# EAGLE schematic LowLevelv3 (EAGLE 9.3.1)

## Sheet 1 of 3
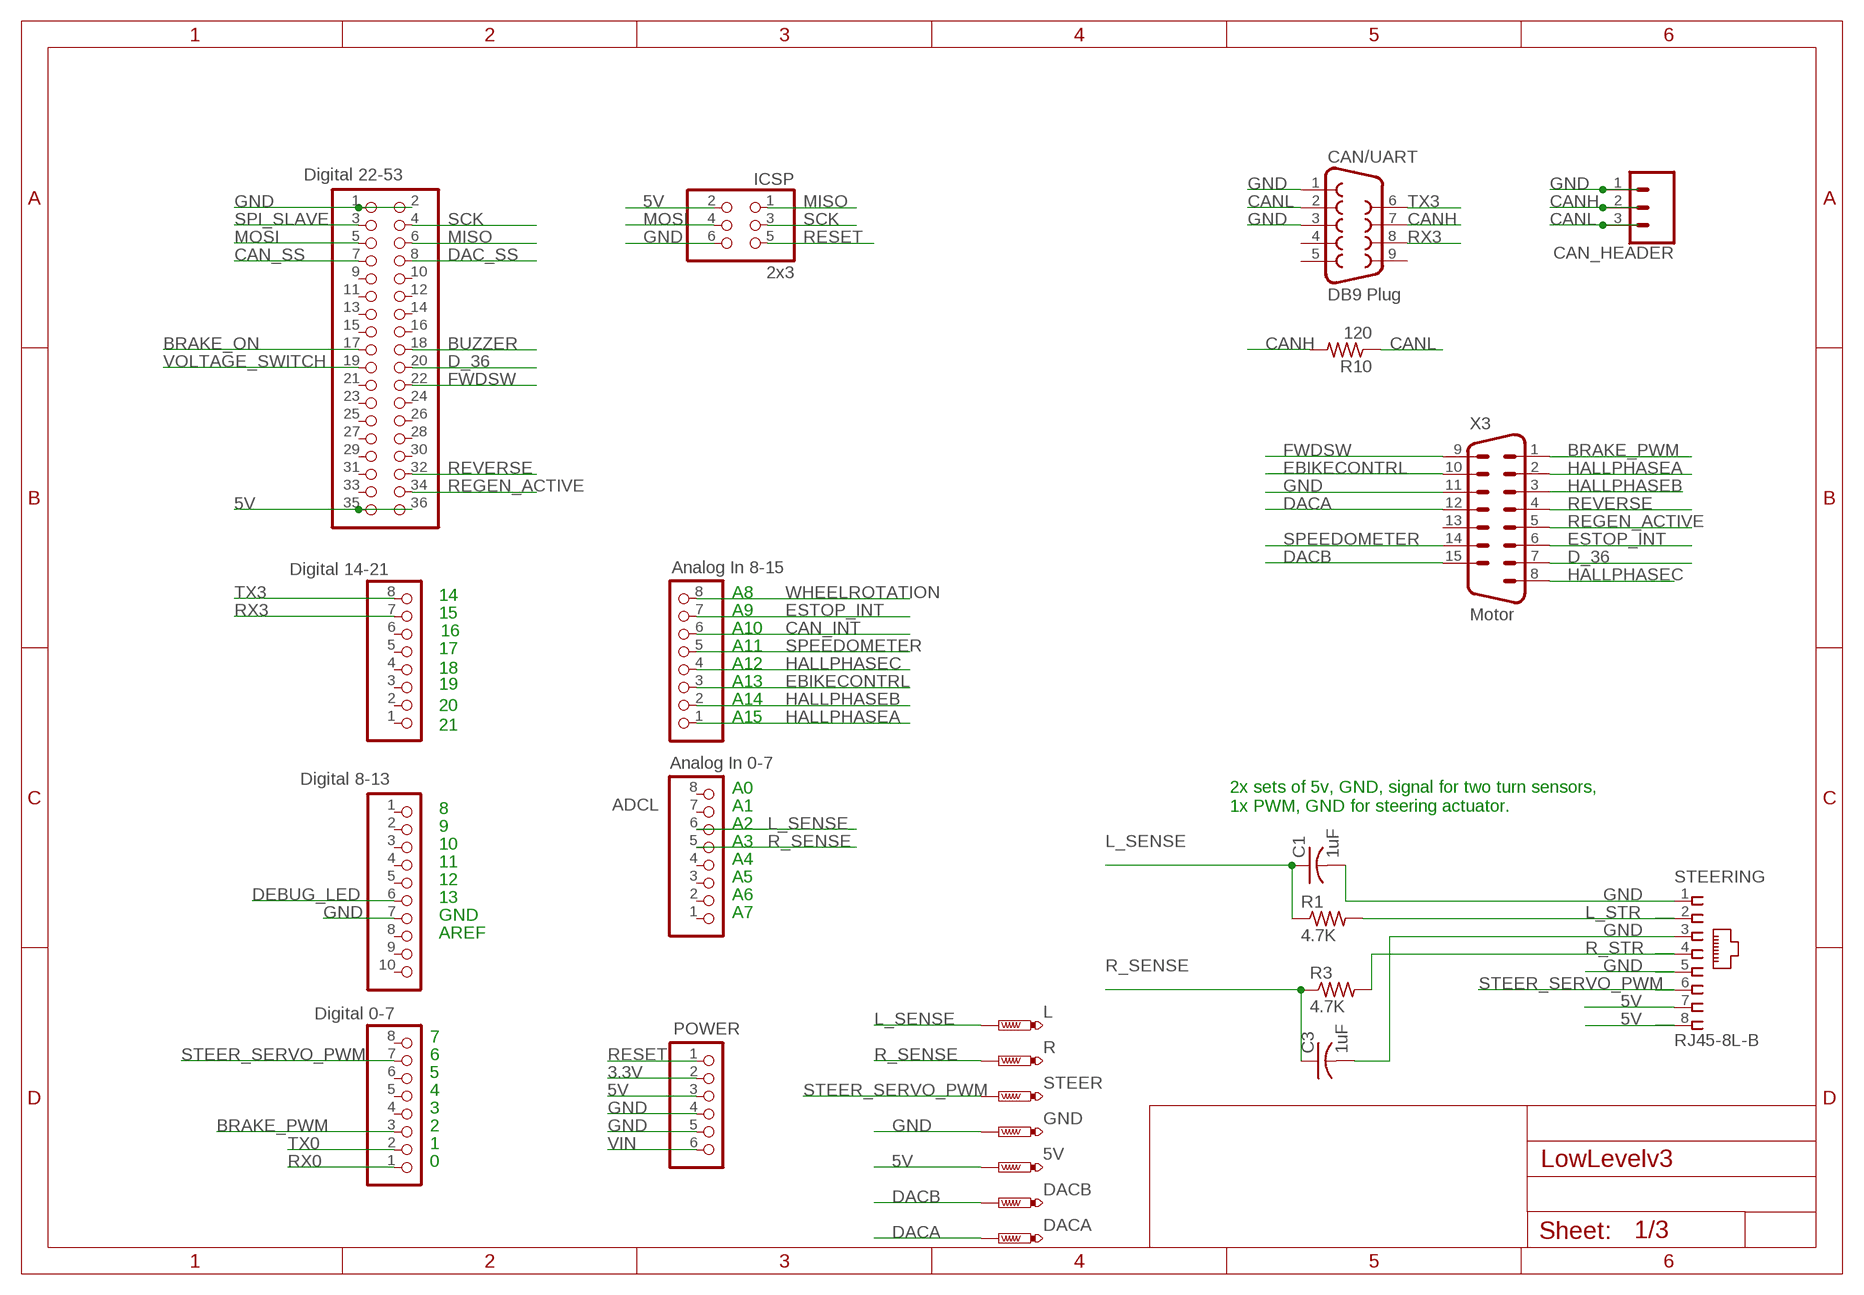
[diagram p0: schematic, sheet 1]

### Parts
5V  PTR1PAD1-17  [P1-17]
ADCH  Analog In 8-15  PINHD-1X8  [1X08]
ADCL  Analog In 0-7  PINHD-1X8  [1X08]
C1  1uF  C-USC1206  [C1206]
C3  1uF  C-USC1206  [C1206]
CAN/UART  DB9 Plug  DB9FEMALE  [DB9]
CAN_HEADER  CONN_03-SCREW-5MM  [SCREWTERMINAL-5MM-3]
DACA  PTR1PAD1-17  [P1-17]
DACB  PTR1PAD1-17  [P1-17]
DIGITAL_0-7  Digital 0-7  PINHD-1X8  [1X08]
DIGITAL_8-13  Digital 8-13  PINHD-1X10  [1X10]
DIGITAL_14-21  Digital 14-21  PINHD-1X8  [1X08]
GND  PTR1PAD1-17  [P1-17]
ICSP  2x3  PINHD-2X3  [2X03]
L  PTR1PAD1-17  [P1-17]
MEGA_EXPANSION  Digital 22-53  PINHEAD_PINHD-2X18  [PINHEAD_2X18]
POWER  PINHD-1X6  [1X06]
R  PTR1PAD1-17  [P1-17]
R1  4.7K  R-US_R1206  [R1206]
R3  4.7K  R-US_R1206  [R1206]
R10  120  R-US_R1206  [R1206]
STEER  PTR1PAD1-17  [P1-17]
STEERING  RJ45-8L-B  [RJ45-NO-SHIELD]
X3  Motor  M15-182  [182-015-MALE]

### Nets
3.3V [Power]: POWER.2
5V [Power]: 5V.TP ICSP.2 MEGA_EXPANSION.35 MEGA_EXPANSION.36 POWER.3 STEERING.7 STEERING.8 ; also sheet 2,3
BRAKE_ON: MEGA_EXPANSION.17 ; also sheet 3
BRAKE_PWM: DIGITAL_0-7.3 X3.1
BUZZER: MEGA_EXPANSION.18 ; also sheet 2
CAN_INT: ADCH.6 ; also sheet 2
CAN_SS [SPI_Signals]: MEGA_EXPANSION.7 ; also sheet 2
CANH: CAN/UART.7 CAN_HEADER.2 R10.2 ; also sheet 2
CANL: CAN/UART.2 CAN_HEADER.3 R10.1 ; also sheet 2
D_36: MEGA_EXPANSION.20 X3.7
DAC_SS [SPI_Signals]: MEGA_EXPANSION.8 ; also sheet 2
DACA: DACA.TP X3.12 ; also sheet 2
DACB: DACB.TP X3.15 ; also sheet 2
DEBUG_LED: DIGITAL_8-13.6 ; also sheet 2
EBIKECONTRL: ADCH.3 X3.10
ESTOP_INT: ADCH.7 X3.6 ; also sheet 2
FWDSW: MEGA_EXPANSION.22 X3.9
GND [Power]: C1.2 C3.2 CAN/UART.1 CAN/UART.3 CAN_HEADER.1 DIGITAL_8-13.7 GND.TP ICSP.6 MEGA_EXPANSION.1 MEGA_EXPANSION.2 POWER.4 POWER.5 STEERING.1 STEERING.3 STEERING.5 X3.11 ; also sheet 2,3
HALLPHASEA: ADCH.1 X3.2
HALLPHASEB: ADCH.2 X3.3
HALLPHASEC: ADCH.4 X3.8
L_SENSE: ADCL.6 C1.1 L.TP R1.1
L_STR: R1.2 STEERING.2
MISO [SPI_Signals]: ICSP.1 MEGA_EXPANSION.6 ; also sheet 2
MOSI [SPI_Signals]: ICSP.4 MEGA_EXPANSION.5 ; also sheet 2
R_SENSE: ADCL.5 C3.1 R3.1 R.TP
R_STR: R3.2 STEERING.4
REGEN_ACTIVE: MEGA_EXPANSION.34 X3.5
RESET: ICSP.5 POWER.1 ; also sheet 2
REVERSE: MEGA_EXPANSION.32 X3.4
RX0: DIGITAL_0-7.1
RX3: CAN/UART.8 DIGITAL_14-21.7
SCK [SPI_Signals]: ICSP.3 MEGA_EXPANSION.4 ; also sheet 2
SPEEDOMETER: ADCH.5 X3.14
SPI_SLAVE [SPI_Signals]: MEGA_EXPANSION.3
STEER_SERVO_PWM: DIGITAL_0-7.7 STEER.TP STEERING.6
TX0: DIGITAL_0-7.2
TX3: CAN/UART.6 DIGITAL_14-21.8
VIN: POWER.6
VOLTAGE_SWITCH: MEGA_EXPANSION.19 ; also sheet 3
WHEELROTATION: ADCH.8 ; also sheet 2
Unconnected: ADCL.1 ADCL.2 ADCL.3 ADCL.4 ADCL.7 ADCL.8 CAN/UART.4 CAN/UART.5 CAN/UART.9 DIGITAL_0-7.4 DIGITAL_0-7.5 DIGITAL_0-7.6 DIGITAL_0-7.8 DIGITAL_8-13.1 DIGITAL_8-13.2 DIGITAL_8-13.3 DIGITAL_8-13.4 DIGITAL_8-13.5 DIGITAL_8-13.8 DIGITAL_8-13.9 DIGITAL_8-13.10 DIGITAL_14-21.1 DIGITAL_14-21.2 DIGITAL_14-21.3 DIGITAL_14-21.4 DIGITAL_14-21.5 DIGITAL_14-21.6 MEGA_EXPANSION.9 MEGA_EXPANSION.10 MEGA_EXPANSION.11 MEGA_EXPANSION.12 MEGA_EXPANSION.13 MEGA_EXPANSION.14 MEGA_EXPANSION.15 MEGA_EXPANSION.16 MEGA_EXPANSION.21 MEGA_EXPANSION.23 MEGA_EXPANSION.24 MEGA_EXPANSION.25 MEGA_EXPANSION.26 MEGA_EXPANSION.27 MEGA_EXPANSION.28 MEGA_EXPANSION.29 MEGA_EXPANSION.30 MEGA_EXPANSION.31 MEGA_EXPANSION.33 X3.13

### Notes on the sheet
- 14 | A8
- 15 | A9
- 16 | A10
- 17 | A11
- 18 | A12
- 19 | A13
- A14
- 20
- A15
- 21
- A0
- A1
- 2x sets of 5v, GND, signal for two turn sensors,
  1x PWM, GND for steering actuator.
- 8
- 9 | A2
- 10 | A3
- 11 | A4
- 12 | A5
- 13 | A6
- GND | A7
- AREF
- 7
- 6
- 5
- 4
- 3
- 2
- 1
- 0

## Sheet 2 of 3
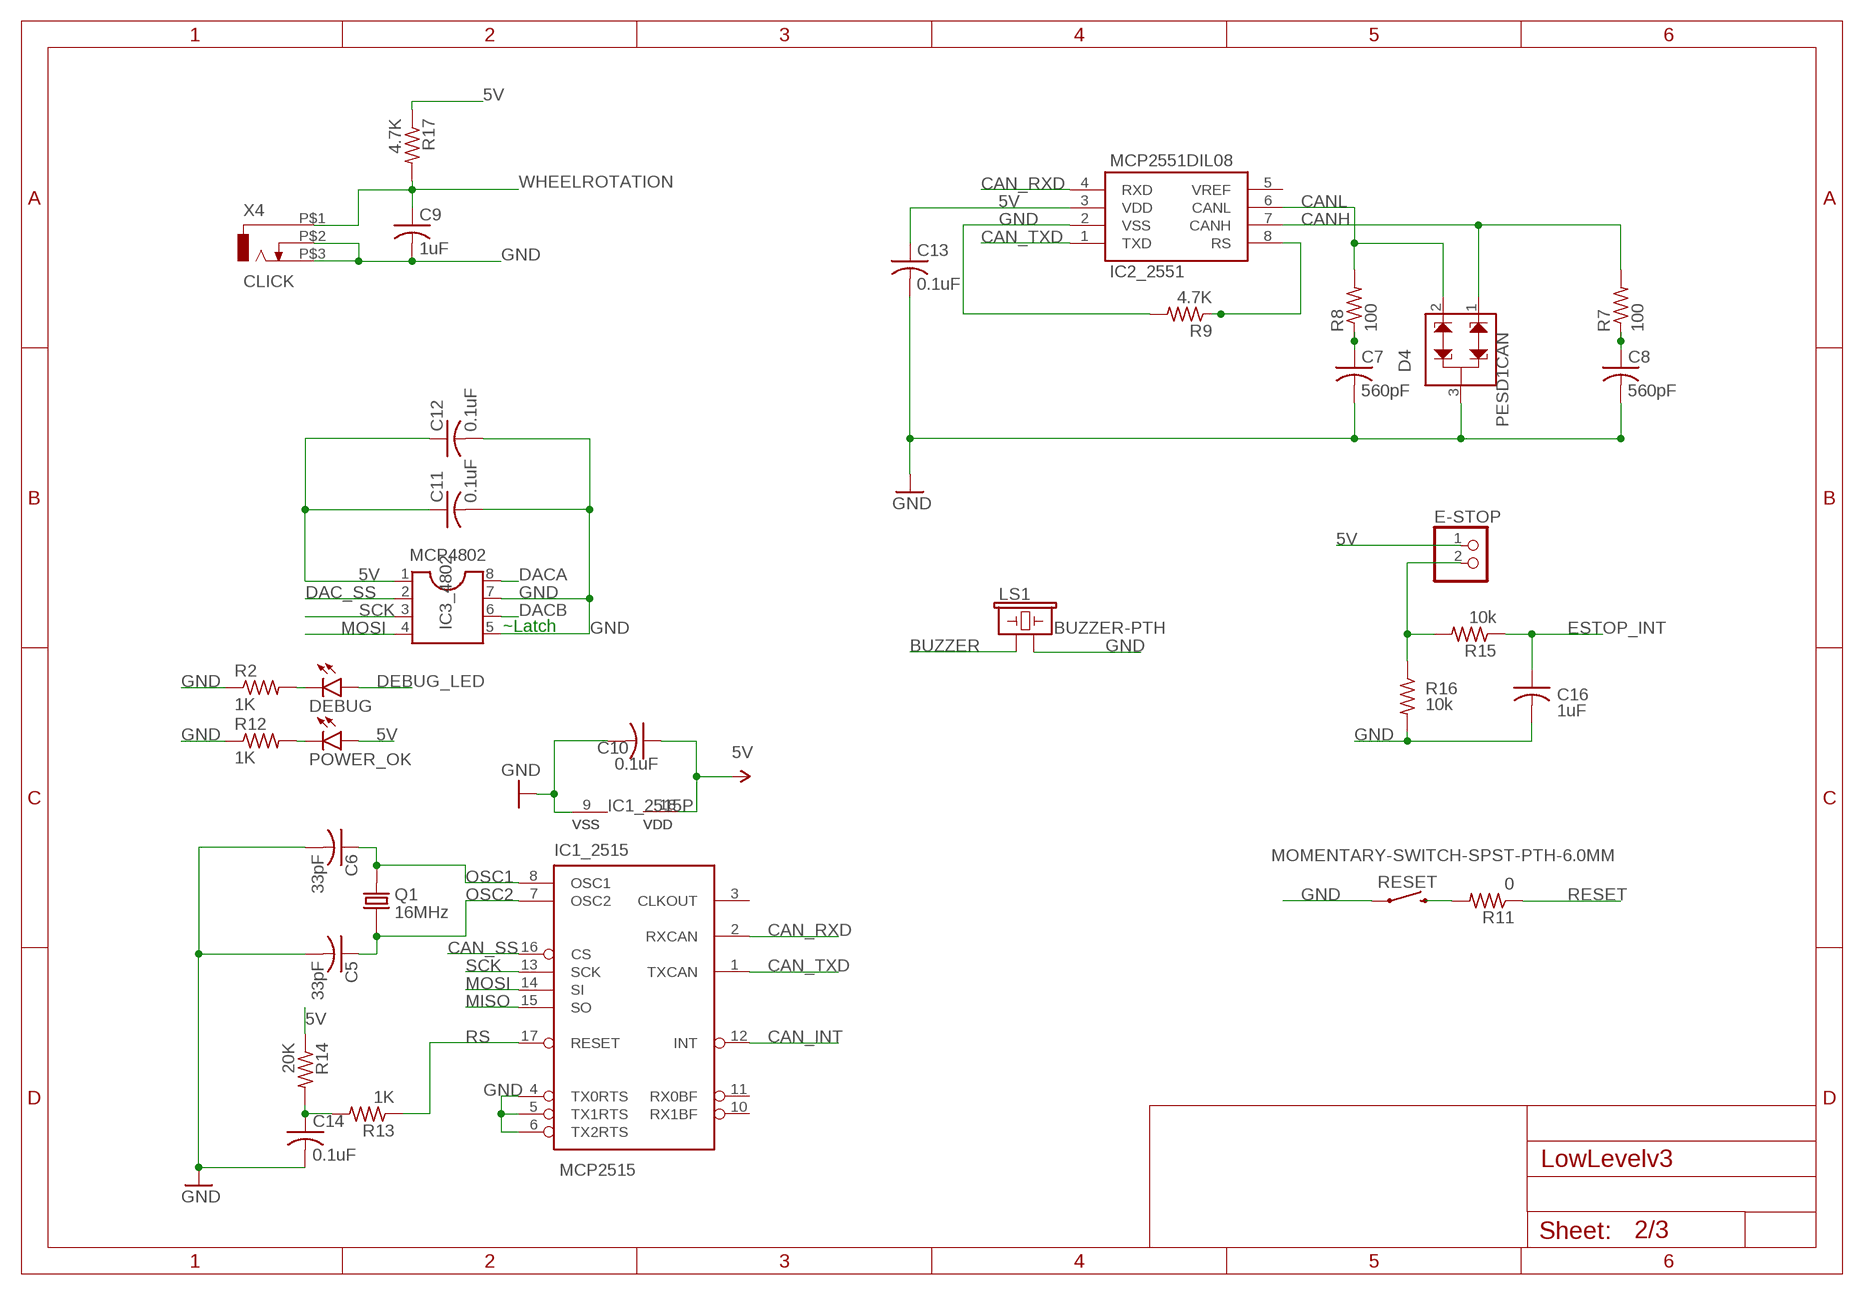
[diagram p1: schematic, sheet 2]

### Parts
C5  33pF  C-USC1206  [C1206]
C6  33pF  C-USC1206  [C1206]
C7  560pF  C-USC1206  [C1206]
C8  560pF  C-USC1206  [C1206]
C9  1uF  C-USC1206  [C1206]
C10  0.1uF  C-USC1206  [C1206]
C11  0.1uF  C-USC1206  [C1206]
C12  0.1uF  C-USC1206  [C1206]
C13  0.1uF  C-USC1206  [C1206]
C14  0.1uF  C-USC1206  [C1206]
C16  1uF  C-USC1206  [C1206]
D4  PESD1CAN  [SPARKFUN-DISCRETESEMI_SOT23-3]
DEBUG  LED3MM  [LED3MM]
E-STOP  PINHD-1X2  [1X02]
IC1_2515  MCP2515  MCP2515(MCP2510)P  [DIP18]
IC2_2551  MCP2551DIL08  [IC-PACKAGE_DIL08]
IC3_4802  MCP4802  DIL8  [DIL08]
LS1  BUZZER-PTH  [BUZZER-12MM]
POWER_OK  LED3MM  [LED3MM]
Q1  16MHz  ECS-160-20-46X  [XTAL_ECS-160-20-46X]
R2  1K  R-US_R1206  [R1206]
R7  100  R-US_R1206  [R1206]
R8  100  R-US_R1206  [R1206]
R9  4.7K  R-US_R1206  [R1206]
R11  0  R-US_R1206  [R1206]
R12  1K  R-US_R1206  [R1206]
R13  1K  R-US_R1206  [R1206]
R14  20K  R-US_R1206  [R1206]
R15  10k  R-US_R1206  [R1206]
R16  10k  R-US_R1206  [R1206]
R17  4.7K  R-US_R1206  [R1206]
RESET  MOMENTARY-SWITCH-SPST-PTH-6.0MM  [TACTILE_SWITCH_PTH_6.0MM]
X4  CLICK  ODO_JACK  [ODO_JACK]

### Nets
5V [Power]: C10.1 C11.1 C12.1 C13.1 E-STOP.1 IC1_2515.18(VDD) IC2_2551.3(VDD) IC3_4802.1 POWER_OK.A R14.1 R17.1 ; also sheet 1,3
BUZZER: LS1.+ ; also sheet 1
CAN_INT: IC1_2515.12(INT) ; also sheet 1
CAN_RXD: IC1_2515.2(RXCAN) IC2_2551.4(RXD)
CAN_SS [SPI_Signals]: IC1_2515.16(CS) ; also sheet 1
CAN_TXD: IC1_2515.1(TXCAN) IC2_2551.1(TXD)
CANH: D4.1 IC2_2551.7(CANH) R7.2 ; also sheet 1
CANL: D4.2 IC2_2551.6(CANL) R8.2 ; also sheet 1
DAC_SS [SPI_Signals]: IC3_4802.2 ; also sheet 1
DACA: IC3_4802.8 ; also sheet 1
DACB: IC3_4802.6 ; also sheet 1
DEBUG_LED: DEBUG.A ; also sheet 1
ESTOP_INT: C16.1 R15.1 ; also sheet 1
GND [Power]: C5.2 C6.2 C7.2 C8.2 C9.2 C10.2 C11.2 C12.2 C13.2 C14.2 C16.2 D4.3 IC1_2515.4(TX0RTS) IC1_2515.5(TX1RTS) IC1_2515.6(TX2RTS) IC1_2515.9(VSS) IC2_2551.2(VSS) IC3_4802.5 IC3_4802.7 LS1.- R2.1 R9.2 R12.1 R16.2 RESET.1 X4.P$2 X4.P$3 ; also sheet 1,3
MISO [SPI_Signals]: IC1_2515.15(SO) ; also sheet 1
MOSI [SPI_Signals]: IC1_2515.14(SI) IC3_4802.4 ; also sheet 1
N$1: R11.2 RESET.3
N$4: C14.1 R13.2 R14.2
N$5: DEBUG.K(C) R2.2
N$8: E-STOP.2 R15.2 R16.1
N$9: C7.1 R8.1
N$10: C8.1 R7.1
N$11: POWER_OK.K(C) R12.2
N$14: IC2_2551.8(RS) R9.1
OSC1 [Oscillator]: C6.1 IC1_2515.8(OSC1) Q1.2
OSC2 [Oscillator]: C5.1 IC1_2515.7(OSC2) Q1.1
RESET: R11.1 ; also sheet 1
RS: IC1_2515.17(RESET) R13.1
SCK [SPI_Signals]: IC1_2515.13(SCK) IC3_4802.3 ; also sheet 1
WHEELROTATION: C9.1 R17.2 X4.P$1 ; also sheet 1
Unconnected: IC1_2515.3(CLKOUT) IC1_2515.10(RX1BF) IC1_2515.11(RX0BF) IC2_2551.5(VREF)

### Notes on the sheet
- ~Latch

## Sheet 3 of 3
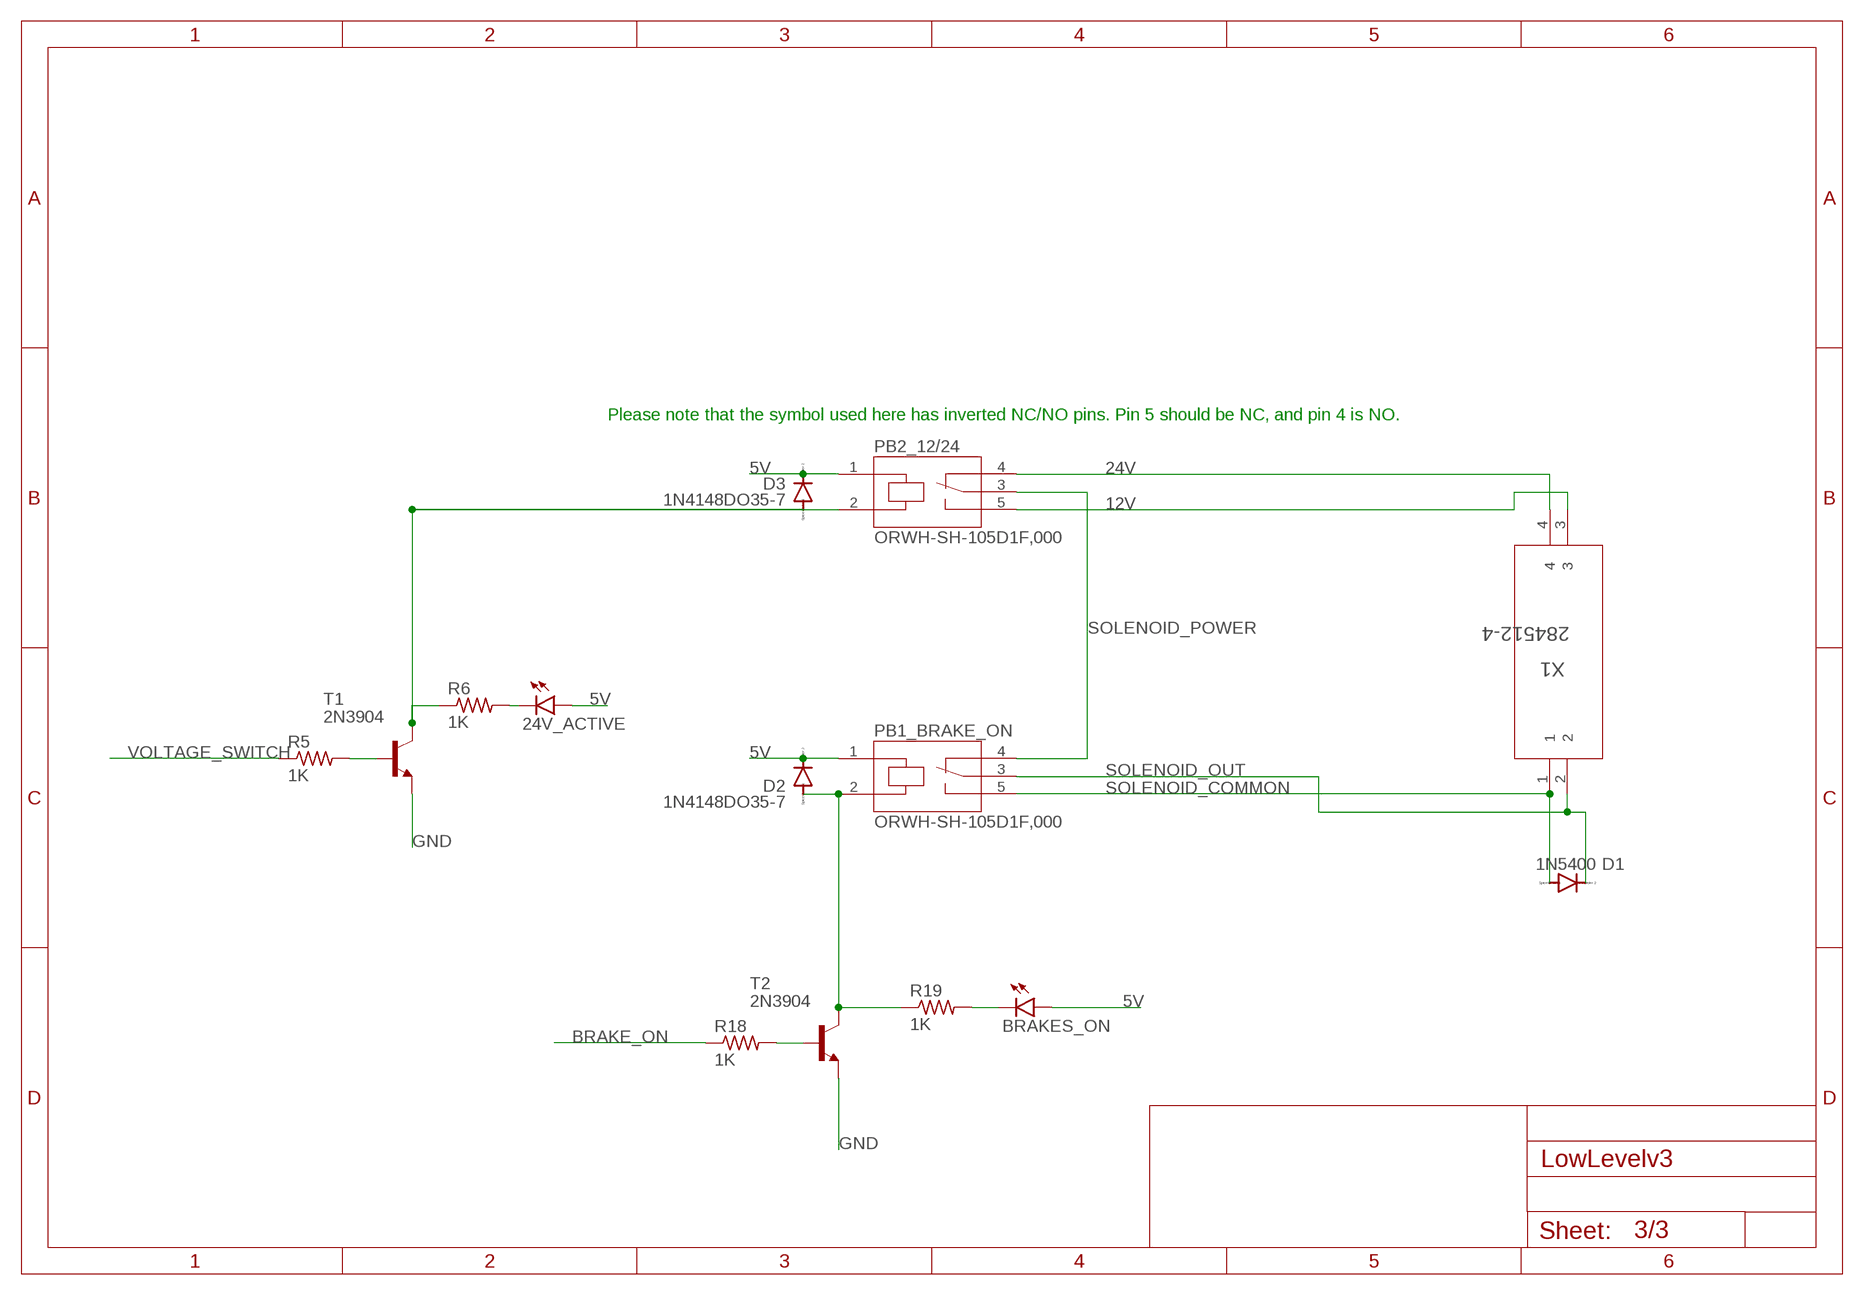
[diagram p2: schematic, sheet 3]

### Parts
24V_ACTIVE  LED3MM  [LED3MM]
BRAKES_ON  LED3MM  [LED3MM]
D1  1N5400  [DO201-15]
D2  1N4148DO35-7  [DO35-7]
D3  1N4148DO35-7  [DO35-7]
PB1_BRAKE_ON  ORWH-SH-105D1F,000  [TE_ORWH-SH-105D1F,000]
PB2_12/24  ORWH-SH-105D1F,000  [TE_ORWH-SH-105D1F,000]
R5  1K  R-US_R1206  [R1206]
R6  1K  R-US_R1206  [R1206]
R18  1K  R-US_R1206  [R1206]
R19  1K  R-US_R1206  [R1206]
T1  2N3904  [TO92]
T2  2N3904  [TO92]
X1  284512-4  [284512-4]

### Nets
5V [Power]: 24V_ACTIVE.A BRAKES_ON.A D2.C D3.C PB1_BRAKE_ON.1(C1) PB2_12/24.1(C1) ; also sheet 1,2
12V [High Current]: PB2_12/24.5(NO) X1.3
24V [High Current]: PB2_12/24.4(NC) X1.4
BRAKE_ON: R18.1 ; also sheet 1
GND [Power]: T1.3(E) T2.3(E) ; also sheet 1,2
N$2: R5.2 T1.2(B)
N$3: D3.A PB2_12/24.2(C2) R6.1 T1.1(C)
N$6: 24V_ACTIVE.K(C) R6.2
N$7: R18.2 T2.2(B)
N$12: D2.A PB1_BRAKE_ON.2(C2) R19.1 T2.1(C)
N$13: BRAKES_ON.K(C) R19.2
SOLENOID_COMMON [High Current]: D1.A PB1_BRAKE_ON.5(NO) X1.1
SOLENOID_OUT [High Current]: D1.C PB1_BRAKE_ON.3(C) X1.2
SOLENOID_POWER [High Current]: PB1_BRAKE_ON.4(NC) PB2_12/24.3(C)
VOLTAGE_SWITCH: R5.1 ; also sheet 1

### Notes on the sheet
- Please note that the symbol used here has inverted NC/NO pins. Pin 5 should be NC, and pin 4 is NO.

## Library data of the parts
5V DACA DACB GND L R STEER = testpad:PTR1: TEST PIN
24V_ACTIVE BRAKES_ON DEBUG POWER_OK = led:LED: LED OSRAM: - CHIPLED LG R971, LG N971, LY N971, LG Q971, LY Q971, LO R971, LY R971 LH N974, LH R974 LS Q976, LO Q976, LY Q976 LO Q996 - Hyper CHIPLED LW Q18S LB Q993, LB Q99A, LB R99A - SideLED LS A670, LO A670, LY A670, LG A670, LP A670 LB A673, LV A673, LT A673, LW A673 LH A674 LY A675 LS A676, LA A676, LO A676, LY A676, LW A676 LS A679, LY A679, LG A679 - Hyper Micro SIDELED® LS Y876, LA Y876, LO Y876, LY Y876 LT Y87S - SmartLED LW L88C, LW L88S LB L89C, LB L89S, LG L890 LS L89K, LO L89K, LY L89K LS L896, LA L896, LO L896, LY L896 - TOPLED LS T670, LO T670, LY T670, LG T670, LP T670 LSG T670, LSP T670, LSY T670, LOP T670, LYG T670 LG T671, LOG T671, LSG T671 LB T673, LV T673, LT T673, LW T673 LH T674 LS T676, LA T676, LO T676, LY T676, LB T676, LH T676, LSB T676, LW T676 LB T67C, LV T67C, LT T67C, LS T67K, LO T67K, LY T67K, LW E67C LS E67B, LA E67B, LO E67B, LY E67B, LB E67C, LV E67C, LT E67C LW T67C LS T679, LY T679, LG T679 LS T770, LO T770, LY T770, LG T770, LP T770 LB T773, LV T773, LT T773, LW T773 LH T774 LS E675, LA E675, LY E675, LS T675 LS T776, LA T776, LO T776, LY T776, LB T776 LHGB T686 LT T68C, LB T68C - Hyper Mini TOPLED® LB M676 - Mini TOPLED Santana® LG M470 LS M47K, LO M47K, LY M47K Source: http://www.osram.convergy.de LUXEON: - LUMILED® LXK2-PW12-R00, LXK2-PW12-S00, LXK2-PW14-U00, LXK2-PW14-V00 LXK2-PM12-R00, LXK2-PM12-S00, LXK2-PM14-U00 LXK2-PE12-Q00, LXK2-PE12-R00, LXK2-PE12-S00, LXK2-PE14-T00, LXK2-PE14-U00 LXK2-PB12-K00, LXK2-PB12-L00, LXK2-PB12-M00, LXK2-PB14-N00, LXK2-PB14-P00, LXK2-PB14-Q00 LXK2-PR12-L00, LXK2-PR12-M00, LXK2-PR14-Q00, LXK2-PR14-R00 LXK2-PD12-Q00, LXK2-PD12-R00, LXK2-PD12-S00 LXK2-PH12-R00, LXK2-PH12-S00 LXK2-PL12-P00, LXK2-PL12-Q00, LXK2-PL12-R00 Source: www.luxeon.com KINGBRIGHT: KA-3528ASYC Source: www.kingbright.com
ADCH ADCL DIGITAL_0-7 DIGITAL_14-21 = pinhead:PINHD-1X8: PIN HEADER
C1 C3 C5-C14 C16 = resistor:C-US: CAPACITOR, American symbol
CAN/UART = SparkFun-Connectors:DB9: DB9 Connector Standard DB9 (D-Sub 9) serial connector. Can be used for CAN bus as well as RS485 and RS232. Footprint production proven. Here is the female version connector we sell at SparkFun: 9 Pin Female Serial Connector - PCB Mount <https://www.sparkfun.com/products/429> (PRT-00429) This connector has been used on the following SparkFun products: SparkFun RS232 Shifter - SMD <https://www.sparkfun.com/products/449> (PRT-00449) SparkFun RS232 Shifter SMD (No DB9) <https://www.sparkfun.com/products/8780> (PRT-08780); PROD_ID: CONN-08194; SPICEPREFIX: X
CAN_HEADER = SparkFun-Connectors:CONN_03: Multi connection point. Often used as Generic Header-pin footprint for 0.1 inch spaced/style header connections On any of the 0.1 inch spaced packages, you can populate with these: Break Away Headers - Straight <https://www.sparkfun.com/products/116> (PRT-00116) Break Away Male Headers - Right Angle <https://www.sparkfun.com/products/553> (PRT-00553) Female Headers <https://www.sparkfun.com/products/115> (PRT-00115) Break Away Headers - Machine Pin <https://www.sparkfun.com/products/117> (PRT-00117) Break Away Female Headers - Swiss Machine Pin <https://www.sparkfun.com/products/743> (PRT-00743) Stackable Header - 3 Pin (Female, 0.1") <https://www.sparkfun.com/products/13875> (PRT-13875) For SCREWTERMINALS and SPRING TERMINALS visit here: Screw Terimnals on SparkFun.com <https://www.sparkfun.com/search/results?term=Screw+Terminals> (5mm/3.5mm/2.54mm spacing) This device is also useful as a general connection point to wire up your design to another part of your project. Our various solder wires solder well into these plated through hole pads. Hook-Up Wire - Assortment (Stranded, 22 AWG) <https://www.sparkfun.com/products/11375> (PRT-11375) Hook-Up Wire - Assortment (Solid Core, 22 AWG) <https://www.sparkfun.com/products/11367> (PRT-11367) View the entire wire category on our website here <https://www.sparkfun.com/categories/141> Special notes: Molex polarized connector foot print use with SKU : PRT-08232 with associated crimp pins and housings.; PROD_ID: CONN-10134; SF_SKU: PRT-08433
D1 = diode:1N5400: DIODE standard rectifier, 3 A, 50 V (Motorola)
D2 D3 = diode:1N4148: DIODE high speed (Philips)
D4 = elcanoParts:PESD1CAN: CAN bus ESD protection diode PESD1CAN is used to protect two CAN bus lines from ESD. Link to datasheet <http://www.nxp.com/documents/data_sheet/PESD1CAN-U.pdf> SparkFun Products: SparkFun CAN-BUS Shield <https://www.sparkfun.com/products/13262> '; SPICEPREFIX: J
DIGITAL_8-13 = pinhead:PINHD-1X10: PIN HEADER
E-STOP = pinhead:PINHD-1X2: PIN HEADER
IC1_2515 = SparkFun-IC-Comms:MCP2515(MCP2510): CAN controller with SPI interface The MCP2515 controller supercedes the MCP2510 while addressing all errata associated with it. The two devices are pin compatible, either can be used with this device. 18-pin package SOIC Simple SPI interface to any MCU. One-shot mode ensures message transmission is attempted only once Databyte filtering Start-of-Frame (SOF) output Low-power CMOS Technology Datasheet <http://www.sparkfun.com/datasheets/DevTools/Arduino/MCP2515.pdf> SparkFun Products CAN-BUS Shield <https://www.sparkfun.com/products/13262> (DEV-13262); PROD_ID: NA-XXXXX; SPICEPREFIX: X
IC2_2551 = elcanoParts:MCP2551: CAN transceiver; SPICEPREFIX: X
IC3_4802 = ic-package:DIL8: Dual In Line / Socket
ICSP = pinhead:PINHD-2X3: PIN HEADER
LS1 = SparkFun-Electromechanical:BUZZER: Buzzer Small round buzzers that operate around the audible 2kHz range. You can use these as speakers to create simple music or user interfaces. Variant Overview: PTH - Mini Speaker - PC Mount 12mm 2.048kHz <https://www.sparkfun.com/products/7950> PTH_KIT - Mini Speaker - PC Mount 12mm 2.048kHz <https://www.sparkfun.com/products/7950> KIT simplifies soldering by adding stop mask to one side of the pads. PTH_NO_SILK - Mini Speaker - PC Mount 12mm 2.048kHz <https://www.sparkfun.com/products/7950> No silkscreen indicator of buzzer outline. PTH_KIT_NO_SILK - Mini Speaker - PC Mount 12mm 2.048kHz <https://www.sparkfun.com/products/7950> KIT package w/o silkscreen SMD - Buzzer Audio Magnetic (CCV-084B16) SMD buzzer used on, e.g. the LilyPad Buzzer <https://www.sparkfun.com/products/8463> and RFID USB Reader <https://www.sparkfun.com/products/9963>. SMD_KIT - Buzzer Audio Magnetic (CCV-084B16) SMD Buzzer with elongated pins to make soldering easier. Used on the SparkFun Simon Says - Surface Mount Soldering Kit <https://www.sparkfun.com/products/10935>.; PROD_ID: COMP-08253; SF_SKU: COM-07950
MEGA_EXPANSION = elcanoParts:PINHEAD_PINHD-2X18: PIN HEADER
PB1_BRAKE_ON PB2_12/24 = elcanoParts:ORWH-SH-105D1F,000: General Purpose Relay, ORWH Series, Power, Non Latching, SPDT, 5 VDC, 10 A; DESCRIPTION: General Purpose Relay, ORWH Series, Power, Non Latching, SPDT, 5 VDC, 10 A; DIGI-KEY_PART_NUMBER: PB2032-ND; DIGI-KEY_PURCHASE_URL: https://www.digikey.com/product-detail/en/te-connectivity-potter-brumfield-relays/ORWH-SH-105D1F,000/PB2032-ND/4925028?utm_source=snapeda&utm_medium=aggregator&utm_campaign=symbol; MF: TE; MP: ORWH-SH-105D1F,000; PACKAGE: None
POWER = pinhead:PINHD-1X6: PIN HEADER
Q1 = elcanoParts:ECS-160-20-46X: QUARTZ CRYSTAL T/H; DESCRIPTION: Crystal 16MHz ±30ppm _Tol_ ±50ppm _Stability_ 20pF FUND 50Ohm; DIGI-KEY_PART_NUMBER: XC1759-ND; DIGI-KEY_PURCHASE_URL: https://www.digikey.com/product-detail/en/ecs-inc/ECS-160-20-46X/XC1759-ND/2676589?utm_source=snapeda&utm_medium=aggregator&utm_campaign=symbol; MF: ECS Inc.; MP: ECS-160-20-46X; PACKAGE: HC46/X ECS International; SPICEPREFIX: B
R1-R3 R5-R19 = resistor:R-US_: RESISTOR, American symbol
RESET = SparkFun-Switches:MOMENTARY-SWITCH-SPST: Momentary Switch (Pushbutton) - SPST Normally-open (NO) SPST momentary switches (buttons, pushbuttons). Variants PTH-12MM - 12mm square, through-hole Momentary Pushbutton Switch - 12mm Square <https://www.sparkfun.com/products/9190> (COM-09190) PTH-6.0MM, PTH-6.0MM-KIT - 6.0mm square, through-hole Mini Pushbutton Switch <https://www.sparkfun.com/products/97> (COM-00097) KIT package intended for soldering kit's - only one side of pads' copper is exposed. PTH-RIGHT-ANGLE-KIT - Right-angle, through-hole Right Angle Tactile Button <https://www.sparkfun.com/products/10791> - Used on SparkFun BigTime Watch Kit <https://www.sparkfun.com/products/11734> SMD-12MM - 12mm square, surface-mount Tactile Button - SMD (12mm) <https://www.sparkfun.com/products/12993> (COM-12993) Used on SparkFun PicoBoard <https://www.sparkfun.com/products/11888> SMD-4.5MM - 4.5mm Square Trackball Switch Used on SparkFun Blackberry Trackballer Breakout <https://www.sparkfun.com/products/13169> SMD-4.6MMX2.8MM - 4.60mm x 2.80mm, surface mount Used on SparkFun SAMD21 Mini Breakout <https://www.sparkfun.com/products/13664> SMD-5.2MM, SMD-5.2-REDUNDANT - 5.2mm square, surface-mount Mini Pushbutton Switch - SMD <https://www.sparkfun.com/products/8720> (COM-08720) Used on Arduino Pro Mini <https://www.sparkfun.com/products/11114> REDUNDANT package connects both switch circuits together SMD-6.0X3.5MM - 6.0 x 3.5mm, surface mount Momentary Reset Switch SMD <https://www.sparkfun.com/products/8229> (COM-08229) SMD-6.2MM-TALL - 6.2mm square, surface mount Tactile Button - SMD (6mm) <https://www.sparkfun.com/products/12992> Used on SparkFun Digital Sandbox <https://www.sparkfun.com/products/12651> SMD-RIGHT-ANGLE - Right-angle, surface mount Used on SparkFun Block for Intel® Edison - Arduino <https://www.sparkfun.com/products/13036>; PROD_ID: SWCH-08441; SF_SKU: COM-00097
STEERING = elcanoParts:RJ45: CORCOM Modular RJ Jacks No Shield Source: www.tycoelectronics.com .. ENG_DS_1654001_1099_RJ_L_0507.pdf; MF: TYCO ELECTRONICS; MPN: RJ45-8L-B; OC_FARNELL: 1279843; OC_NEWARK: 52K4445
T1 T2 = transistor:2N3904: NPN TRANSISTOR
X1 = elcanoParts:284512-4; MANUFACTURER_PART_NUMBER: 2845124; VENDOR: TE Connectivity
X3 = con-subd:M15: SUB-D; OC_FARNELL: unknown; OC_NEWARK: unknown
X4 = elcanoParts:ODO_JACK

## Net classes
0 default: width 0.254 mm, drill 0.305 mm, clearance 0.254 mm
1 Power: width 0.508 mm, drill 0.305 mm, clearance 0.254 mm
2 High Current: width 0.508 mm, drill 0.305 mm, clearance 0.508 mm
3 SPI_Signals: width 0.254 mm, clearance 0.254 mm
4 Oscillator: width 0.254 mm, clearance 0.508 mm